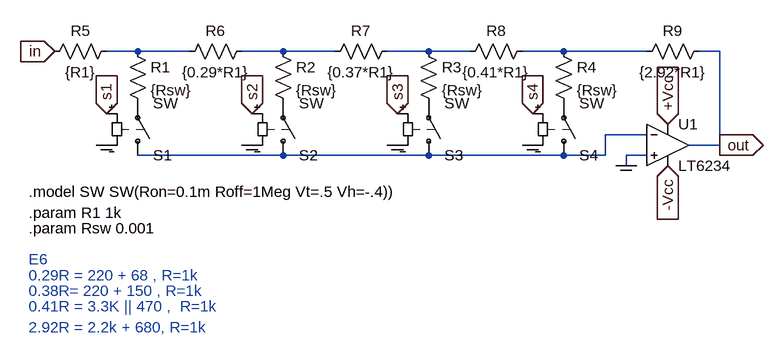
[diagram p0: schematic Etaj3-sumb.asc]
Etaj3-sumb.asc, the LTspice schematic file:
Version 4
SHEET 1 1064 880
WIRE 48 144 0 144
WIRE 128 144 48 144
WIRE 272 144 208 144
WIRE 352 144 272 144
WIRE 496 144 432 144
WIRE 560 144 496 144
WIRE 704 144 640 144
WIRE 832 144 704 144
WIRE 944 144 912 144
WIRE 832 272 768 272
WIRE 944 288 944 144
WIRE 944 288 896 288
WIRE 272 304 48 304
WIRE 496 304 272 304
WIRE 704 304 496 304
WIRE 768 304 768 272
WIRE 768 304 704 304
WIRE 832 304 800 304
WIRE 800 320 800 304
FLAG 656 288 COM
IOPIN 656 288 In
FLAG 864 320 -Vcc
IOPIN 864 320 In
FLAG 864 256 +Vcc
IOPIN 864 256 In
FLAG 0 240 s1
IOPIN 0 240 In
FLAG 224 240 s2
IOPIN 224 240 In
FLAG 448 240 s3
IOPIN 448 240 In
FLAG 656 240 s4
IOPIN 656 240 In
FLAG 944 288 out
IOPIN 944 288 Out
FLAG 800 320 COM
IOPIN 800 320 In
FLAG 448 288 COM
IOPIN 448 288 In
FLAG 224 288 COM
IOPIN 224 288 In
FLAG 0 288 COM
IOPIN 0 288 In
FLAG -80 144 in
IOPIN -80 144 In
SYMBOL res 32 128 R0
SYMATTR InstName R1
SYMATTR Value {Rsw}
SYMBOL res 256 128 R0
SYMATTR InstName R2
SYMATTR Value {Rsw}
SYMBOL res 480 128 R0
SYMATTR InstName R3
SYMATTR Value {Rsw}
SYMBOL sw 48 320 M180
SYMATTR InstName S1
SYMBOL sw 272 320 M180
SYMATTR InstName S2
SYMBOL sw 496 320 M180
SYMATTR InstName S3
SYMBOL sw 704 320 M180
SYMATTR InstName S4
SYMBOL OpAmps\\LT6234 864 288 R0
SYMATTR InstName U1
SYMBOL res 16 128 R90
WINDOW 0 0 56 VBottom 2
WINDOW 3 32 56 VTop 2
SYMATTR InstName R5
SYMATTR Value {R1}
SYMBOL res 224 128 R90
WINDOW 0 0 56 VBottom 2
WINDOW 3 32 56 VTop 2
SYMATTR InstName R6
SYMATTR Value {0.29*R1}
SYMBOL res 448 128 R90
WINDOW 0 0 56 VBottom 2
WINDOW 3 32 56 VTop 2
SYMATTR InstName R7
SYMATTR Value {0.37*R1}
SYMBOL res 656 128 R90
WINDOW 0 0 56 VBottom 2
WINDOW 3 32 56 VTop 2
SYMATTR InstName R8
SYMATTR Value {0.41*R1}
SYMBOL res 928 128 R90
WINDOW 0 0 56 VBottom 2
WINDOW 3 32 56 VTop 2
SYMATTR InstName R9
SYMATTR Value {2.92*R1}
SYMBOL res 688 128 R0
SYMATTR InstName R4
SYMATTR Value {Rsw}
TEXT -120 416 Left 2 !.param Rsw 0.001
TEXT -120 392 Left 2 !.param R1 1k
TEXT -120 360 Left 2 !.model SW SW(Ron=0.1m Roff=1Meg Vt=.5 Vh=-.4))
TEXT -120 488 Left 2 ;0.29R = 220 + 68 , R=1k
TEXT -120 512 Left 2 ;0.38R= 220 + 150 , R=1k
TEXT -120 464 Left 2 ;E6
TEXT -120 536 Left 2 ;0.41R = 3.3K || 470 ,  R=1k
TEXT -120 568 Left 2 ;2.92R = 2.2k + 680, R=1k

The netlist it stands for:
* Etaj3-sumb.asc
R1 N001 P001 {Rsw}
R2 N002 P002 {Rsw}
R3 N003 P003 {Rsw}
S1 N005 P001 s1 COM SW
S2 N005 P002 s2 COM SW
S3 N005 P003 s3 COM SW
S4 N005 P004 s4 COM SW
* U1: LT6234 (symbol OpAmps\LT6234 not available, pins judged from their places): In+=COM In-=N005 V+=+Vcc V-=-Vcc OUT=out
R5 N001 in {R1}
R6 N002 N001 {0.29*R1}
R7 N003 N002 {0.37*R1}
R8 N004 N003 {0.41*R1}
R9 out N004 {2.92*R1}
R4 N004 P004 {Rsw}
.param Rsw 0.001
.param R1 1k
.model SW SW(Ron=0.1m Roff=1Meg Vt=.5 Vh=-.4))
* 0.29R = 220 + 68 , R=1k
* 0.38R= 220 + 150 , R=1k
* E6
* 0.41R = 3.3K || 470 ,  R=1k
* 2.92R = 2.2k + 680, R=1k
.backanno
.end